# Altium schematic sheet LDO.SchDoc
size A; SheetNumber: 4; SheetTotal: 4
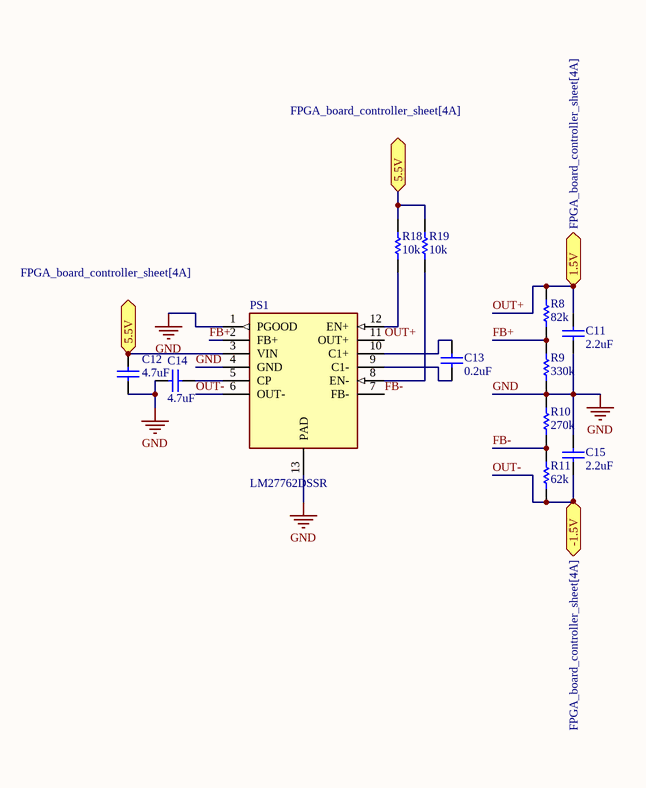
[diagram p0: LDO.SchDoc]

## Parts
C11  2.2uF  [C0603]
C12  4.7uF  [C0603]
C13  0.2uF  [C0603]
C14  4.7uF  [C0603]
C15  2.2uF  [C0603]
PS1  LM27762DSSR  [SON50P200X300X80-13N-D]
R8  82k  [R0603]
R9  330k  [R0603]
R10  270k  [R0603]
R11  62k  [R0603]
R18  10k  [R0603]
R19  10k  [R0603]

## Ports
1.5V (bidir, see FPGA_board_controller_sheet[4A]), 5.5V (bidir, see FPGA_board_controller_sheet[4A]), -1.5V (bidir, see FPGA_board_controller_sheet[4A])

## Nets
GND: C11.1 C12.1 C14.1 C15.2 PS1.1(PGOOD) PS1.4(GND) PS1.13(PAD) R9.1 R10.2
5.5V: C12.2 PS1.3(VIN) R18.2 R19.2 ; port 5.5V
FB+: PS1.2(FB+) R8.1 R9.2
FB-: PS1.7(FB-) R10.1 R11.2
OUT+: C11.2 PS1.11(OUT+) R8.2 ; port 1.5V
OUT-: C15.1 PS1.6(OUT-) R11.1 ; port -1.5V
NetC13_1: C13.1 PS1.9(C1-)
NetC13_2: C13.2 PS1.10(C1+)
NetC14_2: C14.2 PS1.5(CP)
NetPS1_8: PS1.8(EN-) R19.1
NetPS1_12: PS1.12(EN+) R18.1

## Library data of the parts
C11-C15 = Cap: value: *
PS1 = LM27762DSSR: Power Supply; Manufacturer_Name: Texas Instruments; Datasheet Link: https://www.ti.com/lit/ds/symlink/lm27762.pdf; Height: 0.8mm; Manufacturer_Part_Number: LM27762DSSR; Mouser Part Number: 595-LM27762DSSR; Mouser Price/Stock: https://www.mouser.co.uk/ProductDetail/Texas-Instruments/LM27762DSSR?qs=vcbl%252BK4rRlfEJcC9xQ80sA%3D%3D; Arrow Part Number: LM27762DSSR; Arrow Price/Stock: https://www.arrow.com/en/products/lm27762dssr/texas-instruments?region=nac
R8-R11 R18 R19 = Resistor: value: *